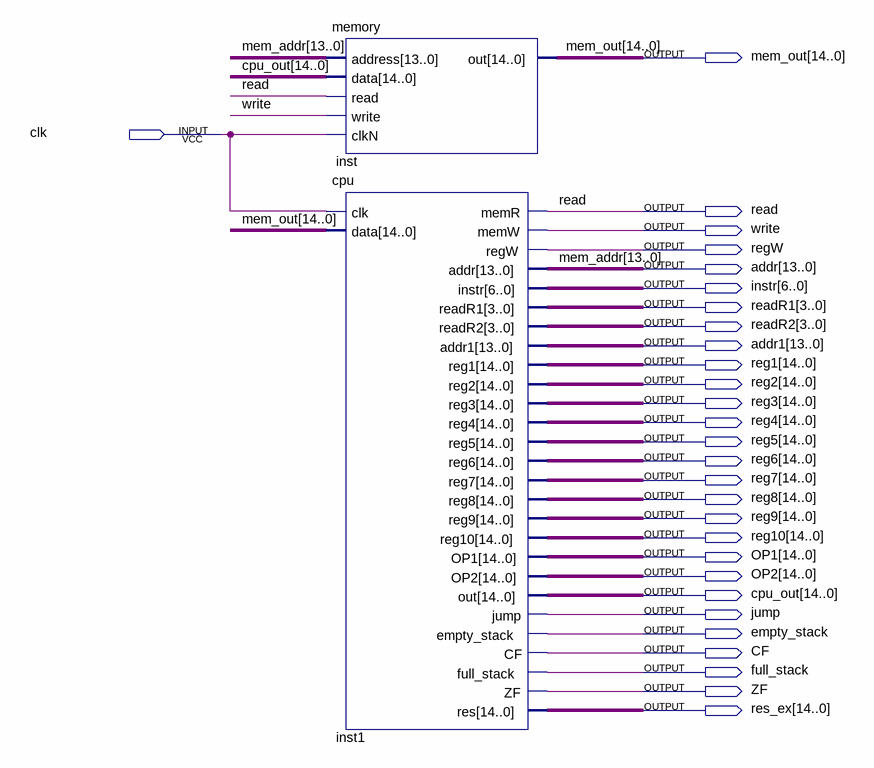
[diagram p0: schematic sheet]
// Quartus schematic cursach.bdf as structural Verilog: 2 symbols, 29 pins
module cursach (
  input  clk,
  output [14:0] mem_out,
  output read,
  output write,
  output regW,
  output [13:0] addr,
  output [6:0] instr,
  output [3:0] readR1,
  output [3:0] readR2,
  output [13:0] addr1,
  output [14:0] reg1,
  output [14:0] reg2,
  output [14:0] reg3,
  output [14:0] reg4,
  output [14:0] reg5,
  output [14:0] reg6,
  output [14:0] reg7,
  output [14:0] reg8,
  output [14:0] reg9,
  output [14:0] reg10,
  output [14:0] OP1,
  output [14:0] OP2,
  output [14:0] cpu_out,
  output jump,
  output empty_stack,
  output CF,
  output full_stack,
  output ZF,
  output [14:0] res_ex
);

  memory inst (.address(addr), .data(cpu_out), .read(read), .write(write), .clkN(clk), .out(mem_out));
  cpu inst1 (
    .clk(clk), .data(mem_out), .memR(read), .memW(write), .regW(regW), .addr(addr), .instr(instr),
    .readR1(readR1), .readR2(readR2), .addr1(addr1), .reg1(reg1), .reg2(reg2), .reg3(reg3), .reg4(reg4),
    .reg5(reg5), .reg6(reg6), .reg7(reg7), .reg8(reg8), .reg9(reg9), .reg10(reg10), .OP1(OP1), .OP2(OP2),
    .out(cpu_out), .jump(jump), .empty_stack(empty_stack), .CF(CF), .full_stack(full_stack), .ZF(ZF),
    .res(res_ex));

  // Other names for the same wires on the sheet: mem_addr[13:0] = addr
endmodule
